# Altium project PLC.PrjPcb
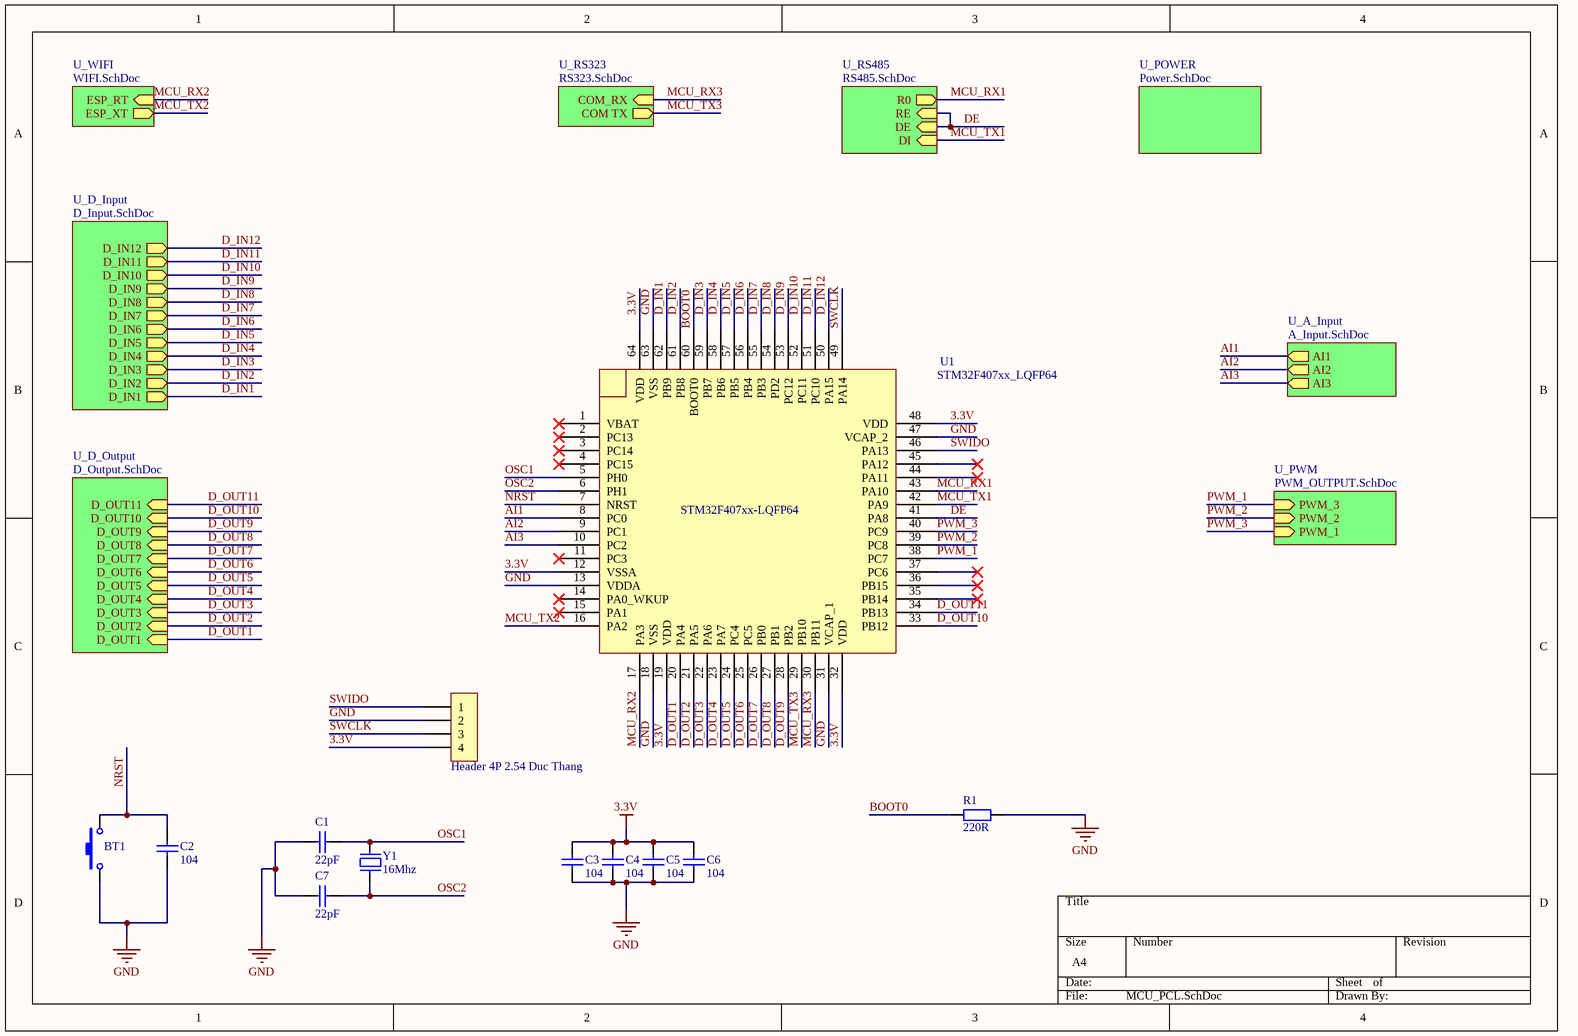
[diagram p0: MCU_PCL.SchDoc]
9 sheets, 164 parts. Net scope: hierarchical (ports join the sheet entries above them; power ports are global).
Board file: PCB1.PcbDoc
Sheets:
  MCU_PCL.SchDoc
    U_WIFI = WIFI.SchDoc
    U_D_Output = D_Output.SchDoc
    U_D_Input = D_Input.SchDoc
    U_PWM = PWM_OUTPUT.SchDoc
    U_RS323 = RS323.SchDoc
    U_RS485 = RS485.SchDoc
    U_A_Input = A_Input.SchDoc
    U_POWER = Power.SchDoc

## Sheet MCU_PCL.SchDoc
size A4; SheetNumber: 1; SheetTotal: 9

### Parts
BT1  Nut Nhan 2 Chan SMD 3x6x2.5  [Nut Nhan 2 Chan SMD 3x6x2.5]  (value not drawn)
C1  22pF  [tu 0805]
C2  104  [tu 0603]
C3  104  [tu 0603]
C4  104  [tu 0603]
C5  104  [tu 0603]
C6  104  [tu 0603]
C7  22pF  [tu 0805]
H1  Header 4P 2.54 Duc Thang  [XH2.54M-4]
R1  220R  [tro smd 0603]
U1  STM32F407xx_LQFP64  [STM32_LQFP64]
Y1  16Mhz  [Thach Anh 2 chan SMD]

### Sub-sheets
U_A_Input = A_Input.SchDoc: AI3 (out), AI1 (out), AI2 (out)
U_D_Input = D_Input.SchDoc: D_IN4 (out), D_IN9 (out), D_IN11 (out), D_IN5 (out), D_IN7 (out), D_IN12 (out), D_IN6 (out), D_IN10 (out), D_IN2 (out), D_IN8 (out), D_IN3 (out), D_IN1 (out)
U_D_Output = D_Output.SchDoc: D_OUT2 (in), D_OUT1 (in), D_OUT3 (in), D_OUT8 (in), D_OUT5 (in), D_OUT11 (in), D_OUT10 (in), D_OUT9 (in), D_OUT6 (in), D_OUT7 (in), D_OUT4 (in)
U_POWER = Power.SchDoc: no entries
U_PWM = PWM_OUTPUT.SchDoc: PWM_3 (in), PWM_2 (in), PWM_1 (in)
U_RS323 = RS323.SchDoc: COM_RX (in), COM TX (out)
U_RS485 = RS485.SchDoc: R0 (out), DE (in), DI (in), RE (in)
U_WIFI = WIFI.SchDoc: ESP_RT (in), ESP_XT (out)

### Nets
3.3V: C3.1 C4.1 C5.1 C6.1 H1.4 U1.12(VSSA) U1.19(VDD) U1.32(VDD) U1.48(VDD) U1.64(VDD)
GND: BT1.1 C1.1 C2.2 C3.2 C4.2 C5.2 C6.2 C7.1 H1.2 R1.2 U1.13(VDDA) U1.18(VSS) U1.31(VCAP_1) U1.47(VCAP_2) U1.63(VSS)
AI1: U1.8(PC0) ; sheet U_A_Input/AI1
AI2: U1.9(PC1) ; sheet U_A_Input/AI2
AI3: U1.10(PC2) ; sheet U_A_Input/AI3
BOOT0: R1.1 U1.60(BOOT0)
D_IN1: U1.62(PB9) ; sheet U_D_Input/D_IN1
D_IN2: U1.61(PB8) ; sheet U_D_Input/D_IN2
D_IN3: U1.59(PB7) ; sheet U_D_Input/D_IN3
D_IN4: U1.58(PB6) ; sheet U_D_Input/D_IN4
D_IN5: U1.57(PB5) ; sheet U_D_Input/D_IN5
D_IN6: U1.56(PB4) ; sheet U_D_Input/D_IN6
D_IN7: U1.55(PB3) ; sheet U_D_Input/D_IN7
D_IN8: U1.54(PD2) ; sheet U_D_Input/D_IN8
D_IN9: U1.53(PC12) ; sheet U_D_Input/D_IN9
D_IN10: U1.52(PC11) ; sheet U_D_Input/D_IN10
D_IN11: U1.51(PC10) ; sheet U_D_Input/D_IN11
D_IN12: U1.50(PA15) ; sheet U_D_Input/D_IN12
D_OUT1: U1.20(PA4) ; sheet U_D_Output/D_OUT1
D_OUT2: U1.21(PA5) ; sheet U_D_Output/D_OUT2
D_OUT3: U1.22(PA6) ; sheet U_D_Output/D_OUT3
D_OUT4: U1.23(PA7) ; sheet U_D_Output/D_OUT4
D_OUT5: U1.24(PC4) ; sheet U_D_Output/D_OUT5
D_OUT6: U1.25(PC5) ; sheet U_D_Output/D_OUT6
D_OUT7: U1.26(PB0) ; sheet U_D_Output/D_OUT7
D_OUT8: U1.27(PB1) ; sheet U_D_Output/D_OUT8
D_OUT9: U1.28(PB2) ; sheet U_D_Output/D_OUT9
D_OUT10: U1.33(PB12) ; sheet U_D_Output/D_OUT10
D_OUT11: U1.34(PB13) ; sheet U_D_Output/D_OUT11
DE: U1.41(PA8) ; sheet U_RS485/DE, sheet U_RS485/RE
MCU_RX1: U1.43(PA10) ; sheet U_RS485/R0
MCU_RX2: U1.17(PA3) ; sheet U_WIFI/ESP_RT
MCU_RX3: U1.30(PB11) ; sheet U_RS323/COM_RX
MCU_TX1: U1.42(PA9) ; sheet U_RS485/DI
MCU_TX2: U1.16(PA2) ; sheet U_WIFI/ESP_XT
MCU_TX3: U1.29(PB10) ; sheet U_RS323/COM TX
NRST: BT1.2 C2.1 U1.7(NRST)
OSC1: C1.2 U1.5(PH0) Y1.2
OSC2: C7.2 U1.6(PH1) Y1.1
PWM_1: U1.38(PC7) ; sheet U_PWM/PWM_3
PWM_2: U1.39(PC8) ; sheet U_PWM/PWM_2
PWM_3: U1.40(PC9) ; sheet U_PWM/PWM_1
SWCLK: H1.3 U1.49(PA14)
SWIDO: H1.1 U1.46(PA13)

Not connected (* = marked no-connect by the designer): U1 1(VBAT)* 2(PC13)* 3(PC14)* 4(PC15)* 11(PC3)* 14(PA0_WKUP)* 15(PA1)* 35(PB14)* 36(PB15)* 37(PC6)* 44(PA11)* 45(PA12)*

### Notes on the sheet
- (in symbol STM32F407xx_LQFP64) STM32F407xx-LQFP64

### Library data of the parts
BT1 = Nut Nhan 2 Chan SMD 3x6x2.5: Ma_Hang: MH001036; Ten: Nút Nhấn 2 Chân 3x6x2.5MM SMD
C1 C7 = Tu 0805 22pF 50V 10%: Dán; Don_Vi: Con; So_Chan: 2; Ten_Linh_Kien: Tụ 0805 22P 10% 50V; Ma_Hang: MH004560; Chung_Loai: Dán; Kieu_Chan: *
C2-C6 = Tu 0603 104 50V 10%: Dán; Don_Vi: Con; So_Chan: 2; Ten_Linh_Kien: Tụ 0603 104-100nF 10% 50V; Ma_Hang: MH004568; Chung_Loai: Dán; Kieu_Chan: *
H1 = Header 4P 2.54 Duc Thang: Cắm; Ten_Linh_Kien: Header 4P XH2.54-4P Đực Thẳng; Don_Vi: Con; Ma_Hang: MH001285; Chung_Loai: Cắm
R1 = Tro 0603 5% 220R: Dán; Don_Vi: Con; So_Chan: 2; Ten_Linh_Kien: Trở 0603 5% 220R; Ma_Hang: MH006322; Chung_Loai: Dán; Kieu_Chan: *
Y1 = Thach Anh 2 chan SMD: Crystal For all Crystal 2pin.; Value: 4Mhz

## Sheet WIFI.SchDoc
size A4; SheetNumber: 5; SheetTotal: 9
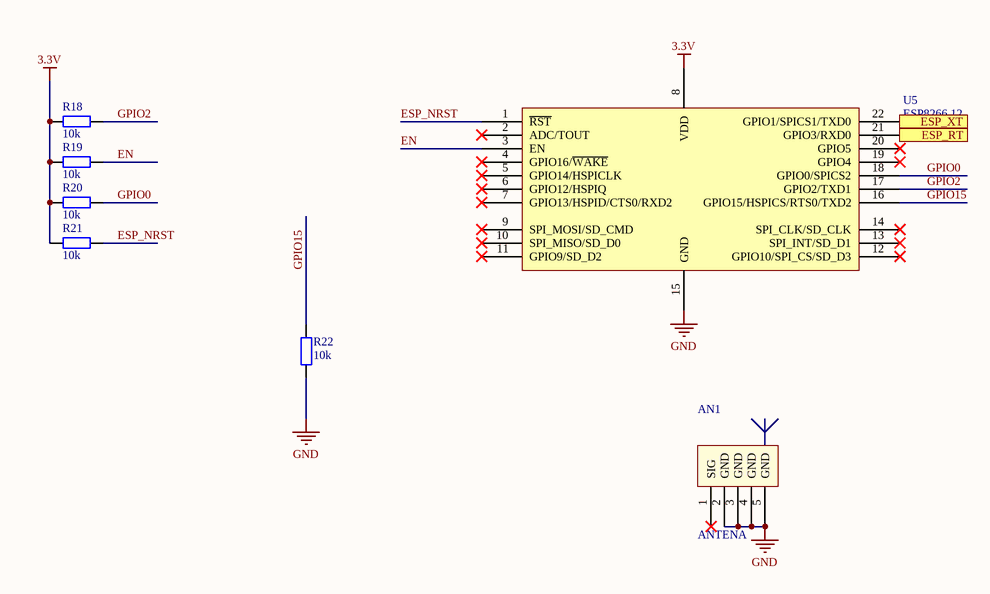
[diagram p1: WIFI.SchDoc]

### Parts
AN1  ANTENA  [DE ANTEN SMA CONG]
R18  10k  [tro smd 0603]
R19  10k  [tro smd 0603]
R20  10k  [tro smd 0603]
R21  10k  [tro smd 0603]
R22  10k  [tro smd 0603]
U5  ESP8266 12  [ESP8266 12]

### Ports
ESP_RT (in), ESP_XT (out)

### Nets
3.3V: R18.1 R19.1 R20.1 R21.1 U5.8(VDD)
GND: AN1.2(GND) AN1.3(GND) AN1.4(GND) AN1.5(GND) R22.1 U5.15(GND)
EN: R19.2 U5.3(EN)
ESP_NRST: R21.2 U5.1(~{RST})
GPIO0: R20.2 U5.18(GPIO0/SPICS2)
GPIO2: R18.2 U5.17(GPIO2/TXD1)
GPIO15: R22.2 U5.16(GPIO15/HSPICS/RTS0/TXD2)
MCU_RX2: U5.21(GPIO3/RXD0) ; port ESP_RT
MCU_TX2: U5.22(GPIO1/SPICS1/TXD0) ; port ESP_XT

Not connected (* = marked no-connect by the designer): AN1 1(SIG)*; U5 2(ADC/TOUT)* 4(GPIO16/~{WAKE})* 5(GPIO14/HSPICLK)* 6(GPIO12/HSPIQ)* 7(GPIO13/HSPID/CTS0/RXD2)* 9(SPI_MOSI/SD_CMD)* 10(SPI_MISO/SD_D0)* 11(GPIO9/SD_D2)* 12(GPIO10/SPI_CS/SD_D3)* 13(SPI_INT/SD_D1)* 14(SPI_CLK/SD_CLK)* 19(GPIO4)* 20(GPIO5)*

### Library data of the parts
AN1 = ANTEN SMA CONG: Generic Antenna
R18-R22 = Tro 0603 5% 10k: Dán; Don_Vi: Con; So_Chan: 2; Ten_Linh_Kien: Trở 0603 5% 10k; Ma_Hang: MH006316; Chung_Loai: Dán; Kieu_Chan: *
U5 = ESP8266 12: ESP8266 12 22 Pin; IC: ESP8266-EX; Vendor: Ai-thinker

## Sheet D_Output.SchDoc
size A4; SheetNumber: 8; SheetTotal: 9
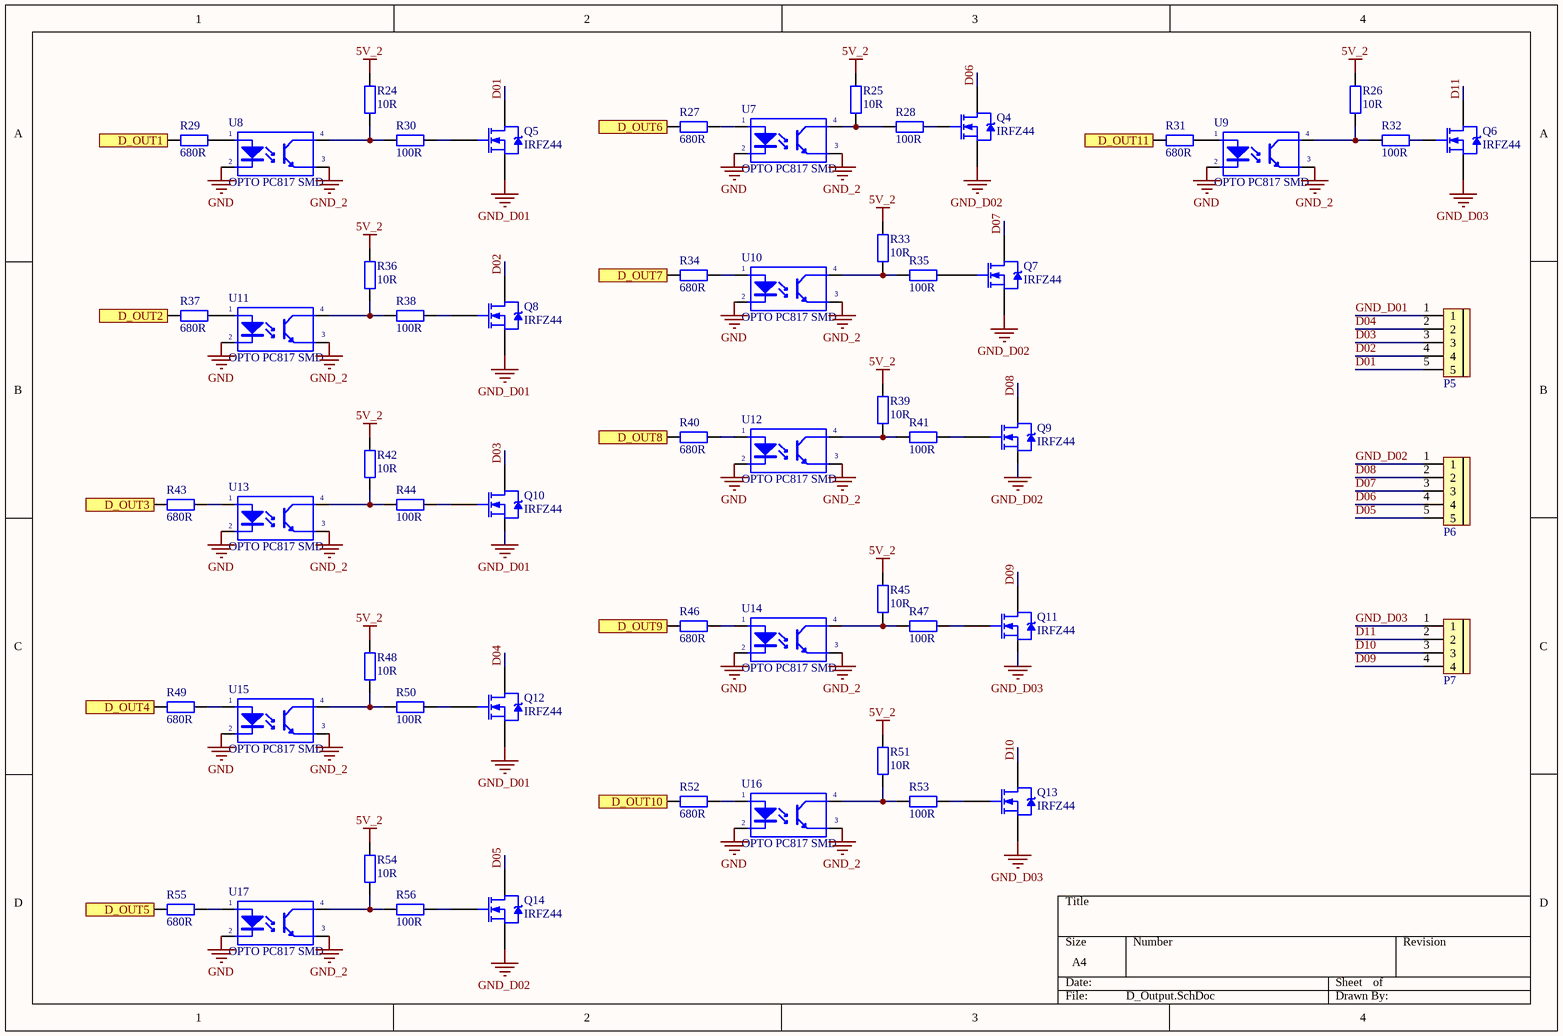
[diagram p2: D_Output.SchDoc]

### Parts
P5  CON 5 EDG5.08  [CON 5 5EDG5.08]  (value not drawn)
P6  CON 5 EDG5.08  [CON 5 5EDG5.08]  (value not drawn)
P7  CON 4 EDG5.08  [CON 4 4EDG5.08]  (value not drawn)
Q4  IRFZ44  [TO220]
Q5  IRFZ44  [TO220]
Q6  IRFZ44  [TO220]
Q7  IRFZ44  [TO220]
Q8  IRFZ44  [TO220]
Q9  IRFZ44  [TO220]
Q10  IRFZ44  [TO220]
Q11  IRFZ44  [TO220]
Q12  IRFZ44  [TO220]
Q13  IRFZ44  [TO220]
Q14  IRFZ44  [TO220]
R24  10R  [Tro smd 0603]
R25  10R  [Tro smd 0603]
R26  10R  [Tro smd 0603]
R27  680R  [tro smd 0603]
R28  100R  [tro smd 0603]
R29  680R  [tro smd 0603]
R30  100R  [tro smd 0603]
R31  680R  [tro smd 0603]
R32  100R  [tro smd 0603]
R33  10R  [Tro smd 0603]
R34  680R  [tro smd 0603]
R35  100R  [tro smd 0603]
R36  10R  [Tro smd 0603]
R37  680R  [tro smd 0603]
R38  100R  [tro smd 0603]
R39  10R  [Tro smd 0603]
R40  680R  [tro smd 0603]
R41  100R  [tro smd 0603]
R42  10R  [Tro smd 0603]
R43  680R  [tro smd 0603]
R44  100R  [tro smd 0603]
R45  10R  [Tro smd 0603]
R46  680R  [tro smd 0603]
R47  100R  [tro smd 0603]
R48  10R  [Tro smd 0603]
R49  680R  [tro smd 0603]
R50  100R  [tro smd 0603]
R51  10R  [Tro smd 0603]
R52  680R  [tro smd 0603]
R53  100R  [tro smd 0603]
R54  10R  [Tro smd 0603]
R55  680R  [tro smd 0603]
R56  100R  [tro smd 0603]
U7  OPTO PC817 SMD  [SOP4]
U8  OPTO PC817 SMD  [SOP4]
U9  OPTO PC817 SMD  [SOP4]
U10  OPTO PC817 SMD  [SOP4]
U11  OPTO PC817 SMD  [SOP4]
U12  OPTO PC817 SMD  [SOP4]
U13  OPTO PC817 SMD  [SOP4]
U14  OPTO PC817 SMD  [SOP4]
U15  OPTO PC817 SMD  [SOP4]
U16  OPTO PC817 SMD  [SOP4]
U17  OPTO PC817 SMD  [SOP4]

### Ports
D_OUT1 (in), D_OUT2 (in), D_OUT3 (in), D_OUT4 (in), D_OUT5 (in), D_OUT6 (in), D_OUT7 (in), D_OUT8 (in), D_OUT9 (in), D_OUT10 (in), D_OUT11 (in)

### Nets
5V_2: R24.2 R25.2 R26.2 R33.2 R36.2 R39.2 R42.2 R45.2 R48.2 R51.2 R54.2
GND: U7.2(K) U8.2(K) U9.2(K) U10.2(K) U11.2(K) U12.2(K) U13.2(K) U14.2(K) U15.2(K) U16.2(K) U17.2(K)
GND_2: U7.3(E) U8.3(E) U9.3(E) U10.3(E) U11.3(E) U12.3(E) U13.3(E) U14.3(E) U15.3(E) U16.3(E) U17.3(E)
GND_D01: P5.1 Q5.3(S) Q8.3(S) Q10.3(S) Q12.3(S)
GND_D02: P6.1 Q4.3(S) Q7.3(S) Q9.3(S) Q14.3(S)
GND_D03: P7.1 Q6.3(S) Q11.3(S) Q13.3(S)
D01: P5.5 Q5.2(D)
D02: P5.4 Q8.2(D)
D03: P5.3 Q10.2(D)
D04: P5.2 Q12.2(D)
D05: P6.5 Q14.2(D)
D06: P6.4 Q4.2(D)
D07: P6.3 Q7.2(D)
D08: P6.2 Q9.2(D)
D09: P7.4 Q11.2(D)
D10: P7.3 Q13.2(D)
D11: P7.2 Q6.2(D)
D_OUT1: R29.1 ; port D_OUT1
D_OUT2: R37.1 ; port D_OUT2
D_OUT3: R43.1 ; port D_OUT3
D_OUT4: R49.1 ; port D_OUT4
D_OUT5: R55.1 ; port D_OUT5
D_OUT6: R27.1 ; port D_OUT6
D_OUT7: R34.1 ; port D_OUT7
D_OUT8: R40.1 ; port D_OUT8
D_OUT9: R46.1 ; port D_OUT9
D_OUT10: R52.1 ; port D_OUT10
D_OUT11: R31.1 ; port D_OUT11
NetQ4_1: Q4.1(G) R28.2
NetQ5_1: Q5.1(G) R30.2
NetQ6_1: Q6.1(G) R32.2
NetQ7_1: Q7.1(G) R35.2
NetQ8_1: Q8.1(G) R38.2
NetQ9_1: Q9.1(G) R41.2
NetQ10_1: Q10.1(G) R44.2
NetQ11_1: Q11.1(G) R47.2
NetQ12_1: Q12.1(G) R50.2
NetQ13_1: Q13.1(G) R53.2
NetQ14_1: Q14.1(G) R56.2
NetR24_1: R24.1 R30.1 U8.4(C)
NetR25_1: R25.1 R28.1 U7.4(C)
NetR26_1: R26.1 R32.1 U9.4(C)
NetR27_2: R27.2 U7.1(A)
NetR29_2: R29.2 U8.1(A)
NetR31_2: R31.2 U9.1(A)
NetR33_1: R33.1 R35.1 U10.4(C)
NetR34_2: R34.2 U10.1(A)
NetR36_1: R36.1 R38.1 U11.4(C)
NetR37_2: R37.2 U11.1(A)
NetR39_1: R39.1 R41.1 U12.4(C)
NetR40_2: R40.2 U12.1(A)
NetR42_1: R42.1 R44.1 U13.4(C)
NetR43_2: R43.2 U13.1(A)
NetR45_1: R45.1 R47.1 U14.4(C)
NetR46_2: R46.2 U14.1(A)
NetR48_1: R48.1 R50.1 U15.4(C)
NetR49_2: R49.2 U15.1(A)
NetR51_1: R51.1 R53.1 U16.4(C)
NetR52_2: R52.2 U16.1(A)
NetR54_1: R54.1 R56.1 U17.4(C)
NetR55_2: R55.2 U17.1(A)

### Library data of the parts
P5 P6 = CON 5 EDG5.08: Cắm; Ten_Linh_Kien: CON 5 2EDG5.08-5P 5.08MM ( Xanh Cong); Ma_Hang: MH003589; Kieu_Chan: *; Don_Vi: Con; Ghi_Chu: *; Chung_Loai: Cắm
P7 = CON 4 EDG5.08: Cắm; Ten_Linh_Kien: CON 4 2EDG5.08-4P 5.08MM ( Xanh Cong); Ma_Hang: MH000979; Don_Vi: Con; Ghi_Chu: *; Kieu_Chan: *; Chung_Loai: Cắm
Q4-Q14 = IRFZ44 DIP: N-Channel Power MOSFET
R24-R26 R33 R36 R39 R42 R45 R48 R51 R54 = Tro 0603 5% 10R: Dán; So_Chan: 2; Ten_Linh_Kien: Trở 0603 5% 10R; Ma_Hang: MH006317; Don_Vi: Con; Chung_Loai: Dán; Kieu_Chan: *
R27 R29 R31 R34 R37 R40 R43 R46 R49 R52 R55 = Tro 0603 1% 680R: Dán; Don_Vi: Con; So_Chan: 2; Ten_Linh_Kien: Trở 0603 1% 680R; Ma_Hang: MH006336; Chung_Loai: Dán; Kieu_Chan: *
R28 R30 R32 R35 R38 R41 R44 R47 R50 R53 R56 = Tro 0603 5% 100R: Dán; Don_Vi: Con; So_Chan: 2; Ten_Linh_Kien: Trở 0603 5% 100R; Ma_Hang: MH006315; Chung_Loai: Dán; Kieu_Chan: *
U7-U17 = OPTO PC817 SMD: Single Opto; Value: PC817

## Sheet D_Input.SchDoc
size A4; SheetNumber: 9; SheetTotal: 9
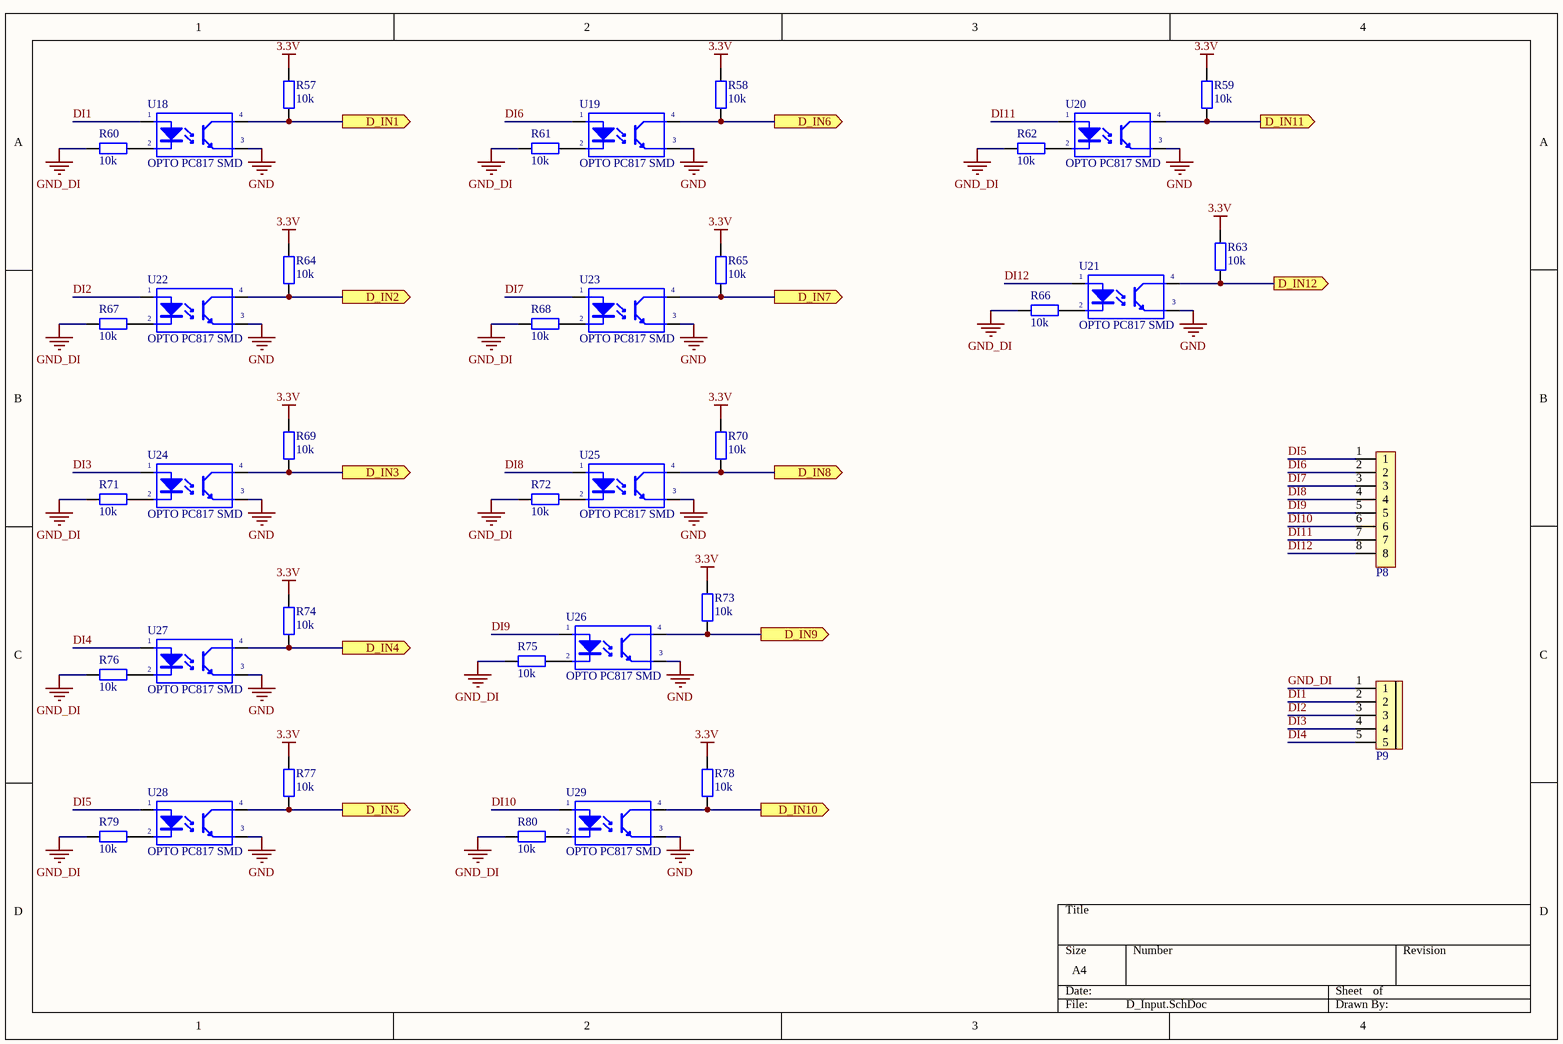
[diagram p3: D_Input.SchDoc]

### Parts
P8  CON 8 EDG5.08  [CON 8 8EDG5.08]  (value not drawn)
P9  CON 5 EDG5.08  [CON 5 5EDG5.08]  (value not drawn)
R57  10k  [tro smd 0603]
R58  10k  [tro smd 0603]
R59  10k  [tro smd 0603]
R60  10k  [tro smd 0603]
R61  10k  [tro smd 0603]
R62  10k  [tro smd 0603]
R63  10k  [tro smd 0603]
R64  10k  [tro smd 0603]
R65  10k  [tro smd 0603]
R66  10k  [tro smd 0603]
R67  10k  [tro smd 0603]
R68  10k  [tro smd 0603]
R69  10k  [tro smd 0603]
R70  10k  [tro smd 0603]
R71  10k  [tro smd 0603]
R72  10k  [tro smd 0603]
R73  10k  [tro smd 0603]
R74  10k  [tro smd 0603]
R75  10k  [tro smd 0603]
R76  10k  [tro smd 0603]
R77  10k  [tro smd 0603]
R78  10k  [tro smd 0603]
R79  10k  [tro smd 0603]
R80  10k  [tro smd 0603]
U18  OPTO PC817 SMD  [SOP4]
U19  OPTO PC817 SMD  [SOP4]
U20  OPTO PC817 SMD  [SOP4]
U21  OPTO PC817 SMD  [SOP4]
U22  OPTO PC817 SMD  [SOP4]
U23  OPTO PC817 SMD  [SOP4]
U24  OPTO PC817 SMD  [SOP4]
U25  OPTO PC817 SMD  [SOP4]
U26  OPTO PC817 SMD  [SOP4]
U27  OPTO PC817 SMD  [SOP4]
U28  OPTO PC817 SMD  [SOP4]
U29  OPTO PC817 SMD  [SOP4]

### Ports
D_IN1 (out), D_IN2 (out), D_IN3 (out), D_IN4 (out), D_IN5 (out), D_IN6 (out), D_IN7 (out), D_IN8 (out), D_IN9 (out), D_IN10 (out), D_IN11 (out), D_IN12 (out)

### Nets
3.3V: R57.2 R58.2 R59.2 R63.2 R64.2 R65.2 R69.2 R70.2 R73.2 R74.2 R77.2 R78.2
GND: U18.3(E) U19.3(E) U20.3(E) U21.3(E) U22.3(E) U23.3(E) U24.3(E) U25.3(E) U26.3(E) U27.3(E) U28.3(E) U29.3(E)
GND_DI: P9.1 R60.2 R61.2 R62.2 R66.2 R67.2 R68.2 R71.2 R72.2 R75.2 R76.2 R79.2 R80.2
D_IN1: R57.1 U18.4(C) ; port D_IN1
D_IN2: R64.1 U22.4(C) ; port D_IN2
D_IN3: R69.1 U24.4(C) ; port D_IN3
D_IN4: R74.1 U27.4(C) ; port D_IN4
D_IN5: R77.1 U28.4(C) ; port D_IN5
D_IN6: R58.1 U19.4(C) ; port D_IN6
D_IN7: R65.1 U23.4(C) ; port D_IN7
D_IN8: R70.1 U25.4(C) ; port D_IN8
D_IN9: R73.1 U26.4(C) ; port D_IN9
D_IN10: R78.1 U29.4(C) ; port D_IN10
D_IN11: R59.1 U20.4(C) ; port D_IN11
D_IN12: R63.1 U21.4(C) ; port D_IN12
DI1: P9.2 U18.1(A)
DI2: P9.3 U22.1(A)
DI3: P9.4 U24.1(A)
DI4: P9.5 U27.1(A)
DI5: P8.1 U28.1(A)
DI6: P8.2 U19.1(A)
DI7: P8.3 U23.1(A)
DI8: P8.4 U25.1(A)
DI9: P8.5 U26.1(A)
DI10: P8.6 U29.1(A)
DI11: P8.7 U20.1(A)
DI12: P8.8 U21.1(A)
NetR60_1: R60.1 U18.2(K)
NetR61_1: R61.1 U19.2(K)
NetR62_1: R62.1 U20.2(K)
NetR66_1: R66.1 U21.2(K)
NetR67_1: R67.1 U22.2(K)
NetR68_1: R68.1 U23.2(K)
NetR71_1: R71.1 U24.2(K)
NetR72_1: R72.1 U25.2(K)
NetR75_1: R75.1 U26.2(K)
NetR76_1: R76.1 U27.2(K)
NetR79_1: R79.1 U28.2(K)
NetR80_1: R80.1 U29.2(K)

### Library data of the parts
P8 = CON 8 EDG5.08: Cắm; Ten_Linh_Kien: CON 8 2EDG5.08-8P 5.08MM ( Xanh Cong); Ma_Hang: MH000978; Don_Vi: Con; Ghi_Chu: *; Kieu_Chan: *; Chung_Loai: Cắm
P9 = CON 5 EDG5.08: as P5 on sheet D_Output; Kieu_Chan: *; Don_Vi: Con; Ghi_Chu: *; Chung_Loai: Cắm
R57-R80 = Tro 0603 5% 10k: as R18 on sheet WIFI; Chung_Loai: Dán; Kieu_Chan: *
U18-U29 = OPTO PC817 SMD: Single Opto; Value: PC817

## Sheet PWM_OUTPUT.SchDoc
size A4; SheetNumber: 2; SheetTotal: 9
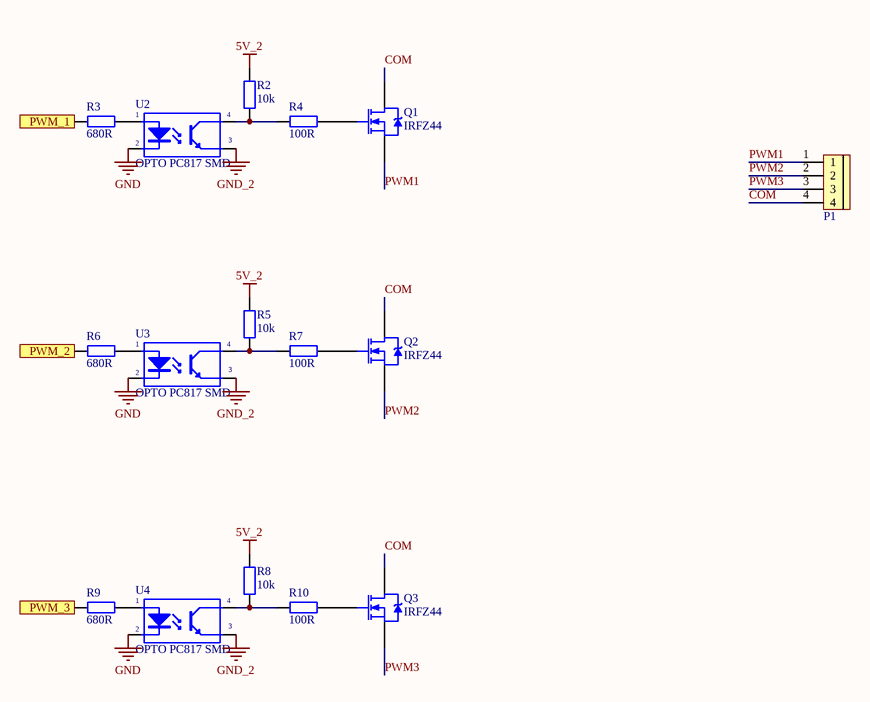
[diagram p4: PWM_OUTPUT.SchDoc]

### Parts
P1  CON 4 EDG5.08  [CON 4 4EDG5.08]  (value not drawn)
Q1  IRFZ44  [TO220]
Q2  IRFZ44  [TO220]
Q3  IRFZ44  [TO220]
R2  10k  [tro smd 0603]
R3  680R  [tro smd 0603]
R4  100R  [tro smd 0603]
R5  10k  [tro smd 0603]
R6  680R  [tro smd 0603]
R7  100R  [tro smd 0603]
R8  10k  [tro smd 0603]
R9  680R  [tro smd 0603]
R10  100R  [tro smd 0603]
U2  OPTO PC817 SMD  [SOP4]
U3  OPTO PC817 SMD  [SOP4]
U4  OPTO PC817 SMD  [SOP4]

### Ports
PWM_1 (in), PWM_2 (in), PWM_3 (in)

### Nets
5V_2: R2.2 R5.2 R8.2
GND: U2.2(K) U3.2(K) U4.2(K)
GND_2: U2.3(E) U3.3(E) U4.3(E)
COM: P1.4 Q1.2(D) Q2.2(D) Q3.2(D)
PWM1: P1.1 Q1.3(S)
PWM2: P1.2 Q2.3(S)
PWM3: P1.3 Q3.3(S)
PWM_1: R9.1 ; port PWM_3
PWM_2: R6.1 ; port PWM_2
PWM_3: R3.1 ; port PWM_1
NetQ1_1: Q1.1(G) R4.2
NetQ2_1: Q2.1(G) R7.2
NetQ3_1: Q3.1(G) R10.2
NetR2_1: R2.1 R4.1 U2.4(C)
NetR3_2: R3.2 U2.1(A)
NetR5_1: R5.1 R7.1 U3.4(C)
NetR6_2: R6.2 U3.1(A)
NetR8_1: R8.1 R10.1 U4.4(C)
NetR9_2: R9.2 U4.1(A)

### Library data of the parts
P1 = CON 4 EDG5.08: as P7 on sheet D_Output; Don_Vi: Con; Ghi_Chu: *; Kieu_Chan: *; Chung_Loai: Cắm
Q1-Q3 = IRFZ44 DIP: N-Channel Power MOSFET
R2 R5 R8 = Tro 0603 5% 10k: as R18 on sheet WIFI; Chung_Loai: Dán; Kieu_Chan: *
R3 R6 R9 = Tro 0603 1% 680R: as R27 on sheet D_Output; Chung_Loai: Dán; Kieu_Chan: *
R4 R7 R10 = Tro 0603 5% 100R: as R28 on sheet D_Output; Chung_Loai: Dán; Kieu_Chan: *
U2-U4 = OPTO PC817 SMD: Single Opto; Value: PC817

## Sheet RS323.SchDoc
size A4; SheetNumber: 3; SheetTotal: 9
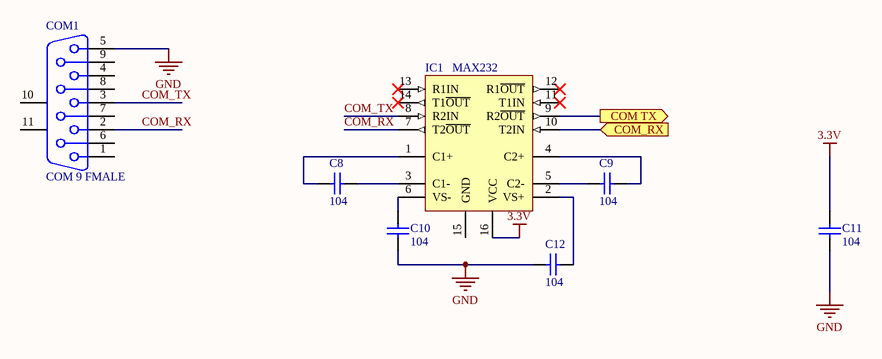
[diagram p5: RS323.SchDoc]

### Parts
C8  104  [tu 0603]
C9  104  [tu 0603]
C10  104  [tu 0603]
C11  104  [tu 0603]
C12  104  [tu 0603]
COM1  COM 9 FMALE  [DSB 9-F]
IC1  MAX232  [sop 16]

### Ports
COM TX (out), COM_RX (in)

### Nets
3.3V: C11.1 IC1.16(VCC)
GND: C10.1 C11.2 C12.1 COM1.5
COM_RX: COM1.2 IC1.7(T2~{OUT})
COM_TX: COM1.3 IC1.8(R2IN)
MCU_RX3: IC1.10(T2IN) ; port COM_RX
MCU_TX3: IC1.9(R2~{OUT}) ; port COM TX
NetC8_1: C8.1 IC1.1(C1+)
NetC8_2: C8.2 IC1.3(C1-)
NetC9_1: C9.1 IC1.5(C2-)
NetC9_2: C9.2 IC1.4(C2+)
NetC10_2: C10.2 IC1.6(VS-)
NetC12_2: C12.2 IC1.2(VS+)

Not connected (* = marked no-connect by the designer): COM1 1 4 6 7 8 9 10(MH1) 11(MH2); IC1 11(T1IN)* 12(R1~{OUT})* 13(R1IN)* 14(T1~{OUT})* 15(GND)

### Library data of the parts
C8-C12 = Tu 0603 104 50V 10%: as C2 on sheet MCU_PCL; Chung_Loai: Dán; Kieu_Chan: *
COM1 = DSB9F: COM 9; PackageDocument: O; Positions: 9; Gender: Receptacle; Value: COM 9; Published: 15-Jun-2001; LatestRevisionDate: 17-Jul-2002; LatestRevisionNote: Re-released for DXP Platform.; DatasheetDocument: 1-Sep-1999; PackageReference: 788750; Publisher: Altium Limited; Orientation: Right Angle
IC1 = MAX232: Dual EIA-232 Driver/Receiver; Value: MAX232

## Sheet RS485.SchDoc
size A4; SheetNumber: 4; SheetTotal: 9
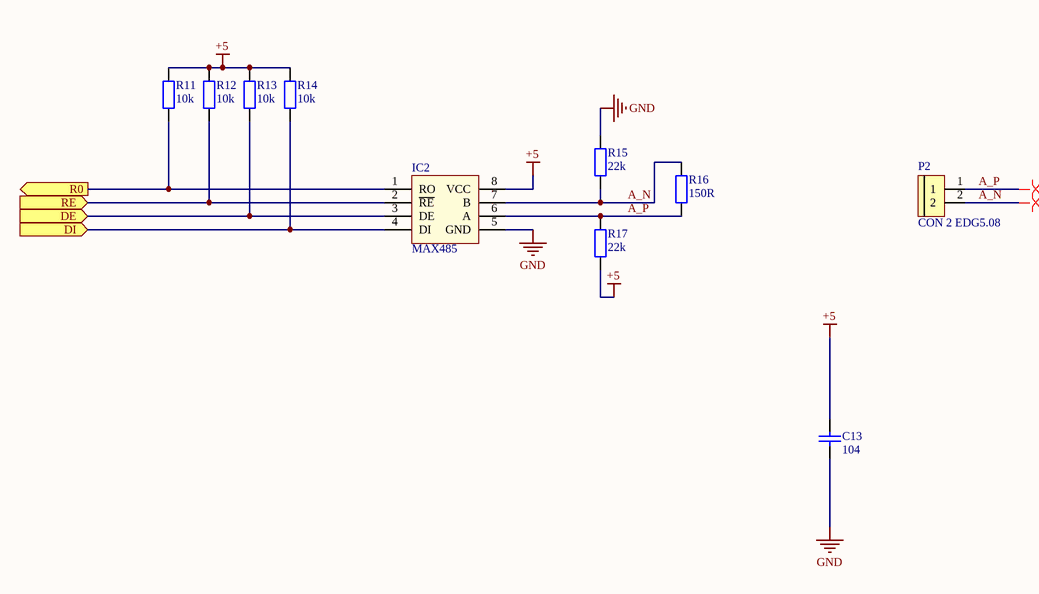
[diagram p6: RS485.SchDoc]

### Parts
C13  104  [tu 0603]
IC2  MAX485  [SO-8]
P2  CON 2 EDG5.08  [CON 2 2EDG5.08]
R11  10k  [tro smd 0603]
R12  10k  [tro smd 0603]
R13  10k  [tro smd 0603]
R14  10k  [tro smd 0603]
R15  22k  [tro smd 0603]
R16  150R  [tro smd 0603]
R17  22k  [tro smd 0603]

### Ports
DE (in), DI (in), R0 (out), RE (in)

### Nets
+5: C13.1 IC2.8(VCC) R11.2 R12.2 R13.2 R14.2 R17.1
GND: C13.2 IC2.5(GND) R15.2
A_N: IC2.7(B) P2.2 R15.1 R16.2
A_P: IC2.6(A) P2.1 R16.1 R17.2
DE: IC2.2(~{RE}) IC2.3(DE) R12.1 R13.1 ; port RE, port DE
MCU_RX1: IC2.1(RO) R11.1 ; port R0
MCU_TX1: IC2.4(DI) R14.1 ; port DI

### Layout directives
differential pair: A_N, A_P

### Library data of the parts
C13 = Tu 0603 104 50V 10%: as C2 on sheet MCU_PCL; Chung_Loai: Dán; Kieu_Chan: *
IC2 = MAX485: RS232 - RS485 (Same sn75176)
P2 = CON 2 EDG5.08: Cắm; Ten_Linh_Kien: CON 2 2EDG5.08-2P 5.08MM ( Xanh Cong); Ma_Hang: MH000759; Ghi_Chu: *; Don_Vi: Con; Kieu_Chan: *; Chung_Loai: Cắm
R11-R14 = Tro 0603 1% 10k: Dán; Don_Vi: Con; So_Chan: 2; Ten_Linh_Kien: Trở 0603 1% 10k; Ma_Hang: MH006333; Chung_Loai: Dán; Kieu_Chan: *
R15 R17 = Tro 0603 1% 22k: Dán; Don_Vi: Con; So_Chan: 2; Ten_Linh_Kien: Trở 0603 1% 22k; Ma_Hang: MH005794; Chung_Loai: Dán; Kieu_Chan: *
R16 = Tro 0603 5% 150R: Dán; Don_Vi: Con; So_Chan: 2; Ten_Linh_Kien: Trở 0603 5% 150R; Ma_Hang: MH006318; Chung_Loai: Dán; Kieu_Chan: *

## Sheet A_Input.SchDoc
size A4; SheetNumber: 7; SheetTotal: 9
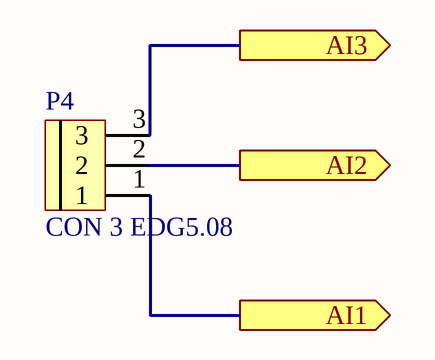
[diagram p7: A_Input.SchDoc]

### Parts
P4  CON 3 EDG5.08  [CON 3 3EDG5.08]

### Ports
AI1 (out), AI2 (out), AI3 (out)

### Nets
AI1: P4.1 ; port AI1
AI2: P4.2 ; port AI2
AI3: P4.3 ; port AI3

### Library data of the parts
P4 = CON 3 EDG5.08: Cắm; Ten_Linh_Kien: CON 3 2EDG5.08-3P 5.08MM ( Xanh Cong); Ma_Hang: MH000760; Ghi_Chu: *; Kieu_Chan: *; Don_Vi: Con; Chung_Loai: Cắm

## Sheet Power.SchDoc
size A4; SheetNumber: 6; SheetTotal: 9
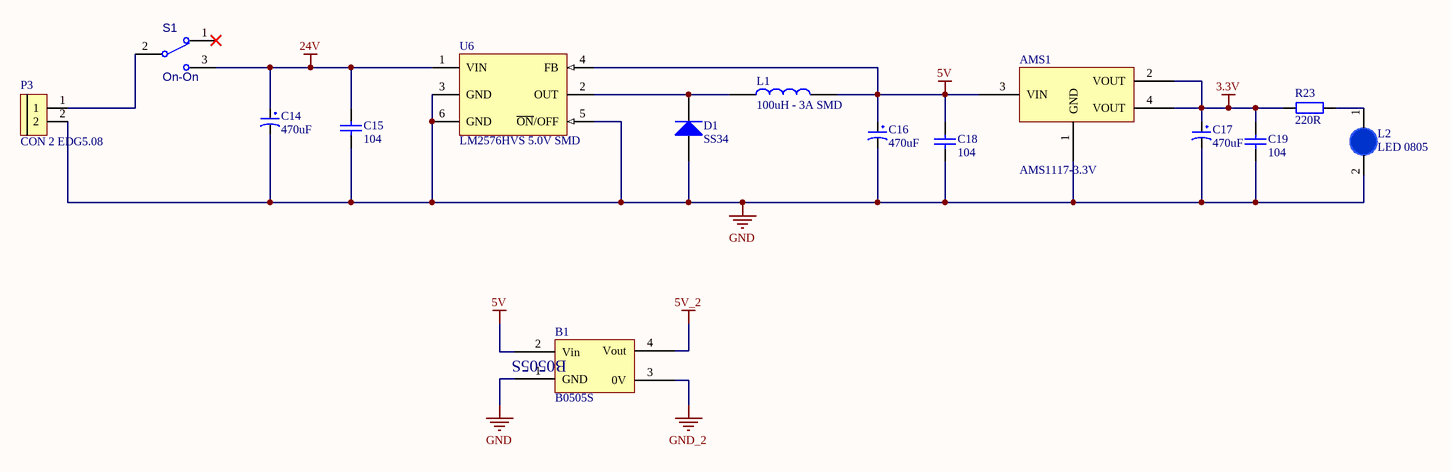
[diagram p8: Power.SchDoc]

### Parts
AMS1  AMS1117-3.3V  [SOT223]
B1  B0505S  [B0505S]
C14  470uF  [tu hoa 10mm]
C15  104  [tu 0603]
C16  470uF  [tu hoa 10mm]
C17  470uF  [tu hoa 10mm]
C18  104  [tu 0603]
C19  104  [tu 0603]
D1  SS34  [DIODE SMA]
L1  100uH - 3A SMD  [Cuon Cam 12x12x10]
L2  LED 0805  [LED-0805-Blue]
P3  CON 2 EDG5.08  [CON 2 2EDG5.08]
R23  220R  [tro smd 0603]
S1  ON-ON  [SWITCH_SPDT_SLIDER]
U6  LM2576HVS 5.0V SMD  [TO263-5]

### Nets
3.3V: AMS1.2(VOUT) AMS1.4(VOUT) C17.1 C19.1 R23.1
5V: AMS1.3(VIN) B1.2(Vin) C16.1 C18.1 L1.2 U6.4(FB)
5V_2: B1.4(Vout)
24V: C14.1 C15.1 S1.3 U6.1(VIN)
GND: AMS1.1(GND) B1.1(GND) C14.2 C15.2 C16.2 C17.2 C18.2 C19.2 D1.1(A) L2.2(K) P3.2 U6.3(GND) U6.5(~{ON}/OFF) U6.6(GND)
GND_2: B1.3(0V)
NetD1_2: D1.2(K) L1.1 U6.2(OUT)
NetL2_1: L2.1(A) R23.2
NetP3_1: P3.1 S1.2

Not connected (* = marked no-connect by the designer): S1 1*

### Library data of the parts
AMS1 = AMS1117 SMD: Dán; Value: AMS1117-3.3V SOT223; Don_Vi: Con; Ma_Hang: MH000596; Ghi_Chu: *; Kieu_Chan: *; Chung_Loai: Dán
B1 = B0505S: Cắm; Ten_Linh_Kien: B0505S-1W SIP4 IC Converter DC-DC; Don_Vi: Con; Ma_Hang: MH003143; Ghi_Chu: *; Kieu_Chan: *; Chung_Loai: Cắm
C14 C16 C17 = Tu Hoa 470uF 35V 10x15: Cắm; Don_Vi: Con; So_Chan: 2; Ten_Linh_Kien: Tụ Hóa 470uF 35V 10x15MM; Ma_Hang: MH002204; Chung_Loai: Cắm; Kieu_Chan: *
C15 C18 C19 = Tu 0603 104 50V 10%: as C2 on sheet MCU_PCL; Chung_Loai: Dán; Kieu_Chan: *
D1 = Diode SS34 ( 1N5822 ): Dán; Don_Vi: Con; Ma_Hang: MH002104; Ten_Linh_Kien: Diode SS34 3A 40V SMA ( 1N5822 SS34A); Kieu_Chan: *; Chung_Loai: Dán
L1 = CUON CAM 100uH SMD: Dán; Don_Vi: Con; Ma_Hang: MH003999; Ten_Linh_Kien: Cuộn Cảm 100uH 7x7x4MM CD74; Ma_Hang: *; Kieu_Chan: *; Chung_Loai: Dán
L2 = LED 0805 Xanh Duong: Dán; Don_Vi: Con; Ma_Hang: MH002327; Ten_Linh_Kien: LED 0805 Màu Xanh Dương (Blue); Ghi_Chu: *; Kieu_Chan: *; Chung_Loai: Dán
P3 = CON 2 EDG5.08: as P2 on sheet RS485; Ghi_Chu: *; Don_Vi: Con; Kieu_Chan: *; Chung_Loai: Cắm
R23 = Tro 0603 5% 220R: as R1 on sheet MCU_PCL; Chung_Loai: Dán; Kieu_Chan: *
S1 = SW_THD_SPDT_On-On: Switch THD vertical toggle SPDT; Manufacturer 1: TE Connectivity; Manufacturer Part Number 1: SLS121PC04; Contact Rating @ Voltage: 0.25A @ 125VAC; SCDType: spec; Circuit: SPDT; Mounting Type: PCB mount; Supplier 1: Digi-Key; Supplier Part Number 1: 450-1598-ND; Switch Function: On-On
U6 = LM2576HVS 5.0V SMD: Dán; Ten_Linh_Kien: LM2576HVS-5.0V BUCK 5V 3A TO263-5; Don_Vi: Con; Ma_Hang: MH002362; Ghi_Chu: *; Kieu_Chan: *; Chung_Loai: Dán

## Nets that join several sheets
3.3V: MCU_PCL (10 pins), WIFI (5 pins), D_Input (12 pins), RS323 (C11.1 IC1.16), Power (5 pins)
5V_2: D_Output (11 pins), PWM_OUTPUT (R2.2 R5.2 R8.2), Power (B1.4)
GND: MCU_PCL (15 pins), WIFI (6 pins), D_Output (11 pins), D_Input (12 pins), PWM_OUTPUT (U2.2 U3.2 U4.2), RS323 (C10.1 C11.2 C12.1 COM1.5), RS485 (C13.2 IC2.5 R15.2), Power (14 pins)
GND_2: D_Output (11 pins), PWM_OUTPUT (U2.3 U3.3 U4.3), Power (B1.3)
AI1: MCU_PCL (U1.8), A_Input (P4.1)
AI2: MCU_PCL (U1.9), A_Input (P4.2)
AI3: MCU_PCL (U1.10), A_Input (P4.3)
D_IN1: MCU_PCL (U1.62), D_Input (R57.1 U18.4)
D_IN2: MCU_PCL (U1.61), D_Input (R64.1 U22.4)
D_IN3: MCU_PCL (U1.59), D_Input (R69.1 U24.4)
D_IN4: MCU_PCL (U1.58), D_Input (R74.1 U27.4)
D_IN5: MCU_PCL (U1.57), D_Input (R77.1 U28.4)
D_IN6: MCU_PCL (U1.56), D_Input (R58.1 U19.4)
D_IN7: MCU_PCL (U1.55), D_Input (R65.1 U23.4)
D_IN8: MCU_PCL (U1.54), D_Input (R70.1 U25.4)
D_IN9: MCU_PCL (U1.53), D_Input (R73.1 U26.4)
D_IN10: MCU_PCL (U1.52), D_Input (R78.1 U29.4)
D_IN11: MCU_PCL (U1.51), D_Input (R59.1 U20.4)
D_IN12: MCU_PCL (U1.50), D_Input (R63.1 U21.4)
D_OUT1: MCU_PCL (U1.20), D_Output (R29.1)
D_OUT2: MCU_PCL (U1.21), D_Output (R37.1)
D_OUT3: MCU_PCL (U1.22), D_Output (R43.1)
D_OUT4: MCU_PCL (U1.23), D_Output (R49.1)
D_OUT5: MCU_PCL (U1.24), D_Output (R55.1)
D_OUT6: MCU_PCL (U1.25), D_Output (R27.1)
D_OUT7: MCU_PCL (U1.26), D_Output (R34.1)
D_OUT8: MCU_PCL (U1.27), D_Output (R40.1)
D_OUT9: MCU_PCL (U1.28), D_Output (R46.1)
D_OUT10: MCU_PCL (U1.33), D_Output (R52.1)
D_OUT11: MCU_PCL (U1.34), D_Output (R31.1)
DE: MCU_PCL (U1.41), RS485 (IC2.2 IC2.3 R12.1 R13.1)
MCU_RX1: MCU_PCL (U1.43), RS485 (IC2.1 R11.1)
MCU_RX2: MCU_PCL (U1.17), WIFI (U5.21)
MCU_RX3: MCU_PCL (U1.30), RS323 (IC1.10)
MCU_TX1: MCU_PCL (U1.42), RS485 (IC2.4 R14.1)
MCU_TX2: MCU_PCL (U1.16), WIFI (U5.22)
MCU_TX3: MCU_PCL (U1.29), RS323 (IC1.9)
PWM_1: MCU_PCL (U1.38), PWM_OUTPUT (R9.1)
PWM_2: MCU_PCL (U1.39), PWM_OUTPUT (R6.1)
PWM_3: MCU_PCL (U1.40), PWM_OUTPUT (R3.1)